# Altium schematic sheet Sheet3.SchDoc
size A4; SheetNumber: 3; SheetTotal: 5
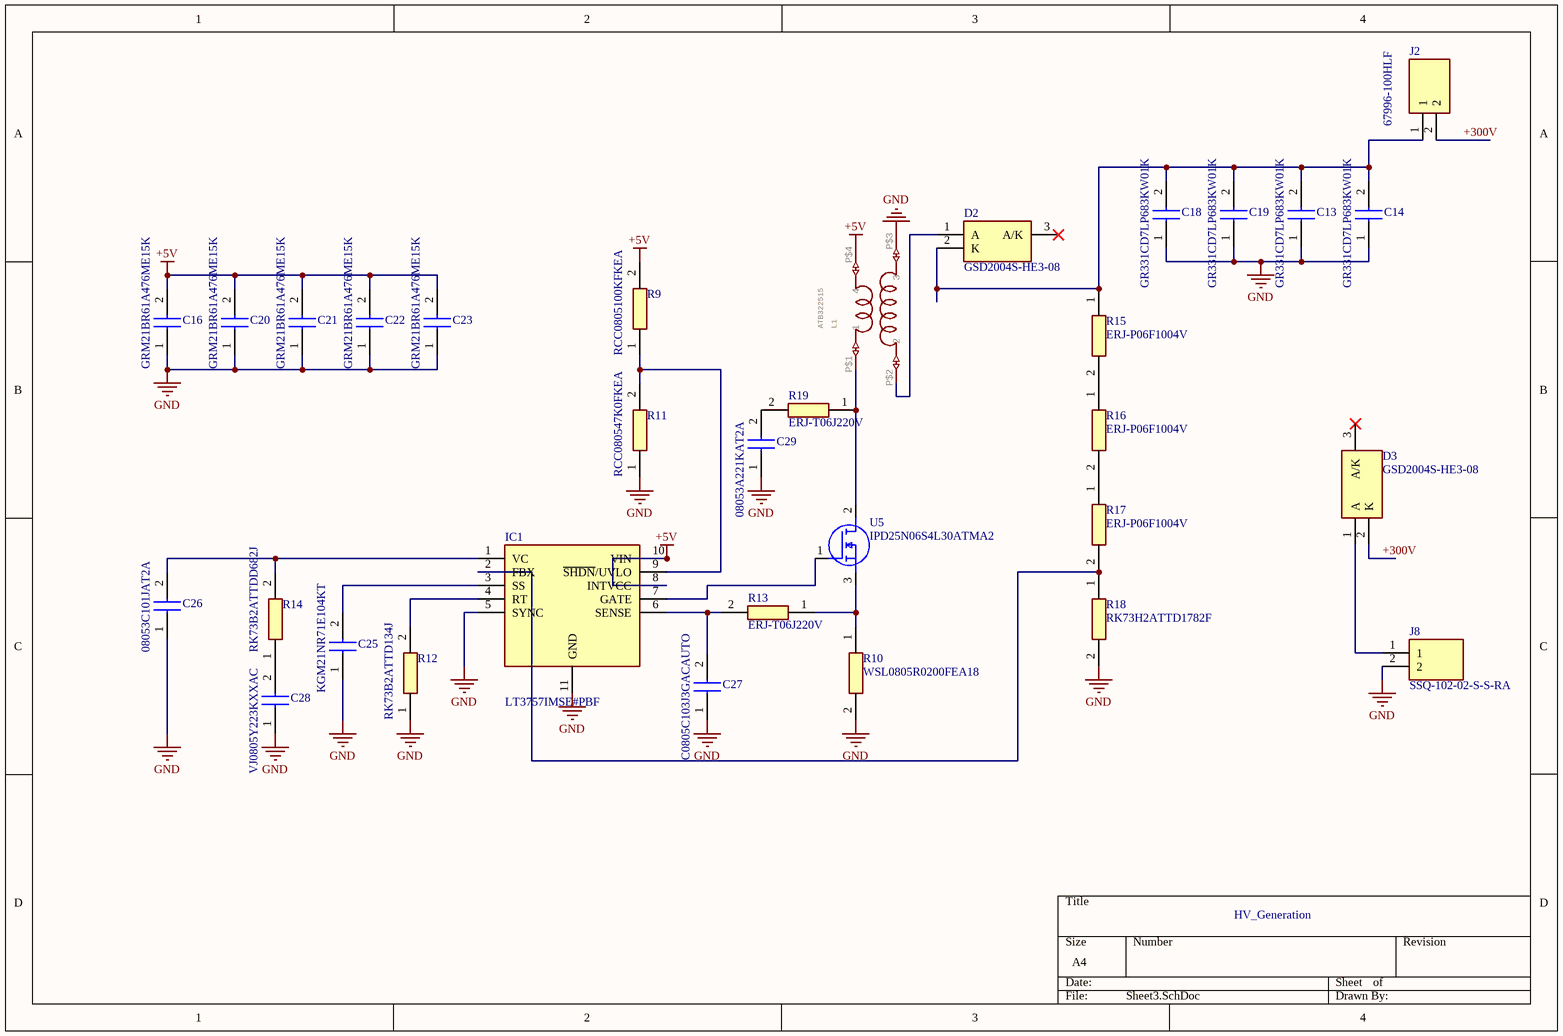
[diagram p0: Sheet3.SchDoc]

## Parts
C13  GR331CD7LP683KW01K  [C3216_Commercial]
C14  GR331CD7LP683KW01K  [C3216_Commercial]
C16  GRM21BR61A476ME15K  [CAPC2012X100N]
C18  GR331CD7LP683KW01K  [C3216_Commercial]
C19  GR331CD7LP683KW01K  [C3216_Commercial]
C20  GRM21BR61A476ME15K  [CAPC2012X100N]
C21  GRM21BR61A476ME15K  [CAPC2012X100N]
C22  GRM21BR61A476ME15K  [CAPC2012X100N]
C23  GRM21BR61A476ME15K  [CAPC2012X100N]
C25  KGM21NR71E104KT  [CAPC2012X100N]
C26  08053C101JAT2A  [CAPC2012X100N]
C27  C0805C103J3GACAUTO  [CAPC2012X100N]
C28  VJ0805Y223KXXAC  [CAPC2012X100N]
C29  08053A221KAT2A  [CAPC2012X100N]
D2  GSD2004S-HE3-08  [SOT95P248X115-3N]
D3  GSD2004S-HE3-08  [SOT95P248X115-3N]
IC1  LT3757IMSE#PBF  [SOP50P490X110-11N]
J2  67996-100HLF  [HDRV2W67P254_2X1_254X483X858P]
J8  SSQ-102-02-S-S-RA  [RHDRRA2W64P254_1X2_559X851X241P]
L1  ATB322515  [ATB322515]
R9  RCC0805100KFKEA  [RESC2012X60N]
R10  WSL0805R0200FEA18  [RESC2012X60N]
R11  RCC080547K0FKEA  [RESC2012X60N]
R12  RK73B2ATTD134J  [RESC2012X60N]
R13  ERJ-T06J220V  [RESC2012X60N]
R14  RK73B2ATTDD682J  [RESC2012X60N]
R15  ERJ-P06F1004V  [RESC2012X60N]
R16  ERJ-P06F1004V  [RESC2012X60N]
R17  ERJ-P06F1004V  [RESC2012X60N]
R18  RK73H2ATTD1782F  [RESC2012X60N]
R19  ERJ-T06J220V  [RESC2012X60N]
U5  IPD25N06S4L30ATMA2  [IPD25N06S4L30ATMA2]

## Nets
+5V: C16.2 C20.2 C21.2 C22.2 C23.2 IC1.8(INTVCC) IC1.10(VIN) L1.P$4(4) R9.2
GND: C13.1 C14.1 C16.1 C18.1 C19.1 C20.1 C21.1 C22.1 C23.1 C25.1 C26.1 C27.1 C28.1 C29.1 IC1.5(SYNC) IC1.11(GND) J8.2 L1.P$3(3) R10.2 R11.1 R12.1 R18.2
+300V: D3.2(K) J2.2
NetC13_2: C13.2 C14.2 C18.2 C19.2 D2.2(K) J2.1 R15.1
NetC25_2: C25.2 IC1.3(SS)
NetC26_2: C26.2 IC1.1(VC) R14.2
NetC27_2: C27.2 IC1.6(SENSE) R13.2
NetC28_2: C28.2 R14.1
NetC29_2: C29.2 R19.2
NetD2_1: D2.1(A) L1.P$2(2)
NetD3_1: D3.1(A) J8.1
NetIC1_2: IC1.2(FBX) R17.2 R18.1
NetIC1_4: IC1.4(RT) R12.2
NetIC1_7: IC1.7(GATE) U5.1(G)
NetIC1_9: IC1.9(~{SHDN}/UVLO) R9.1 R11.2
NetL1_P$1: L1.P$1(1) R19.1 U5.2(D)
NetR10_1: R10.1 R13.1 U5.3(S)
NetR15_2: R15.2 R16.1
NetR16_2: R16.2 R17.1

Not connected (* = marked no-connect by the designer): D2 3(A/K)*; D3 3(A/K)*

## Notes on the sheet
- HV_Generation

## Library data of the parts
C13 C14 C18 C19 = C3216X7T2W683K130AA: Capacitor; Manufacturer_Name: TDK; Datasheet Link: https://product.tdk.com/system/files/dam/doc/product/capacitor/ceramic/mlcc/catalog/mlcc_commercial_midvoltage_en.pdf; Height: 0.75mm; Manufacturer_Part_Number: C3216X7T2W683K130AA
C16 C20-C23 C25-C29 = KGM21NR71E104KT: Capacitor; Manufacturer_Name: KYOCERA; Datasheet Link: https://spicat.kyocera-avx.com/product/mlcc/chartview/KGM21NR71E104KT/DataSheet/X7R; Height: 1mm; Manufacturer_Part_Number: KGM21NR71E104KT; Mouser Part Number: 581-KGM21NR71E104KT; Mouser Price/Stock: https://www.mouser.co.uk/ProductDetail/KYOCERA-AVX/KGM21NR71E104KT?qs=OcgtsXO%252B3gt5l3KgnBGsBw%3D%3D
D2 D3 = GSD2004S-HE3-08: Diode; Manufacturer_Name: Vishay; Datasheet Link: https://eagle.componentsearchengine.com/Datasheets/1/GSD2004S-HE3-08.pdf; Height: 1.15mm; Manufacturer_Part_Number: GSD2004S-HE3-08; Mouser Part Number: 78-GSD2004S-HE3-08; Mouser Price/Stock: https://www.mouser.co.uk/ProductDetail/Vishay-Semiconductors/GSD2004S-HE3-08?qs=uS%252BVSIFnvp5GJDCoADy1cg%3D%3D; Arrow Part Number: GSD2004S-HE3-08; Arrow Price/Stock: https://www.arrow.com/en/products/gsd2004s-he3-08/vishay?region=nac
IC1 = LT3757IMSE#PBF: Integrated Circuit; Manufacturer_Name: Analog Devices; Datasheet Link: https://datasheet.datasheetarchive.com/originals/distributors/Datasheets-SFU4/DSASF4000-3305.pdf; Height: 1.1mm; Manufacturer_Part_Number: LT3757IMSE#PBF; Mouser Part Number: 584-LT3757IMSE#PBF; Mouser Price/Stock: https://www.mouser.co.uk/ProductDetail/Analog-Devices/LT3757IMSEPBF?qs=hVkxg5c3xu%252BnKf7DPP6rNg%3D%3D; Arrow Part Number: LT3757IMSE#PBF; Arrow Price/Stock: https://www.arrow.com/en/products/lt3757imsepbf/analog-devices?region=europe
J2 = 67996-100HLF: BergStik<sup>&reg;</sup>, Board to Board connector, Unshrouded vertical header, Through Hole, Double Row, 0 Positions, 2.54 mm (0.100in) Pitch; Manufacturer_Name: Amphenol Communications Solutions; Geometry.Height: 8.58mm; Mouser Part Number: *; Mouser Price/Stock: *; Manufacturer_Part_Number: 67996-100HLF; Datasheet Link: https://cdn.amphenol-cs.com/media/wysiwyg/files/drawing/67996.pdf
J8 = SSQ-102-02-S-S-RA: Connector; Manufacturer_Name: SAMTEC; Datasheet Link: http://suddendocs.samtec.com/catalog_english/ssq_th.pdf; Height: 2.41mm; Manufacturer_Part_Number: SSQ-102-02-S-S-RA; Arrow Part Number: SSQ-102-02-S-S-RA; Arrow Price/Stock: https://www.arrow.com/en/products/ssq-102-02-s-s-ra/samtec
L1 = ATB322515: GateName_1: G$1; SymbolName_1: ATB322515; LibraryName: kajimoto; DeviceSetName: ATB322515; Package: ATB322515
R9-R19 = RK73B2ATTD123J: Resistor; Manufacturer_Name: KOA Speer; Datasheet Link: https://www.mouser.jp/datasheet/2/219/RK73B-1825463.pdf; Height: 0.6mm; Manufacturer_Part_Number: RK73B2ATTD123J
U5 = IPD25N06S4L30ATMA2: MOSFET (N-Channel); Manufacturer_Name: Infineon; Description: Trans MOSFET N-CH 60V 25A Automotive 3-Pin(2+Tab) DPAK T/R002; Datasheet Link: https://www.infineon.com/dgdl/Infineon-IPD25N06S4L-30-DS-v01_01-EN.pdf?fileId=db3a30431ff98815012038898f7b0caa; Height: 2.5mm; Manufacturer_Part_Number: IPD25N06S4L30ATMA2; Arrow Part Number: IPD25N06S4L30ATMA2; Arrow Price/Stock: https://www.arrow.com/en/products/ipd25n06s4l30atma2/infineon-technologies-ag?region=nac